# Altium schematic sheet USB_Host.SchDoc
size Letter
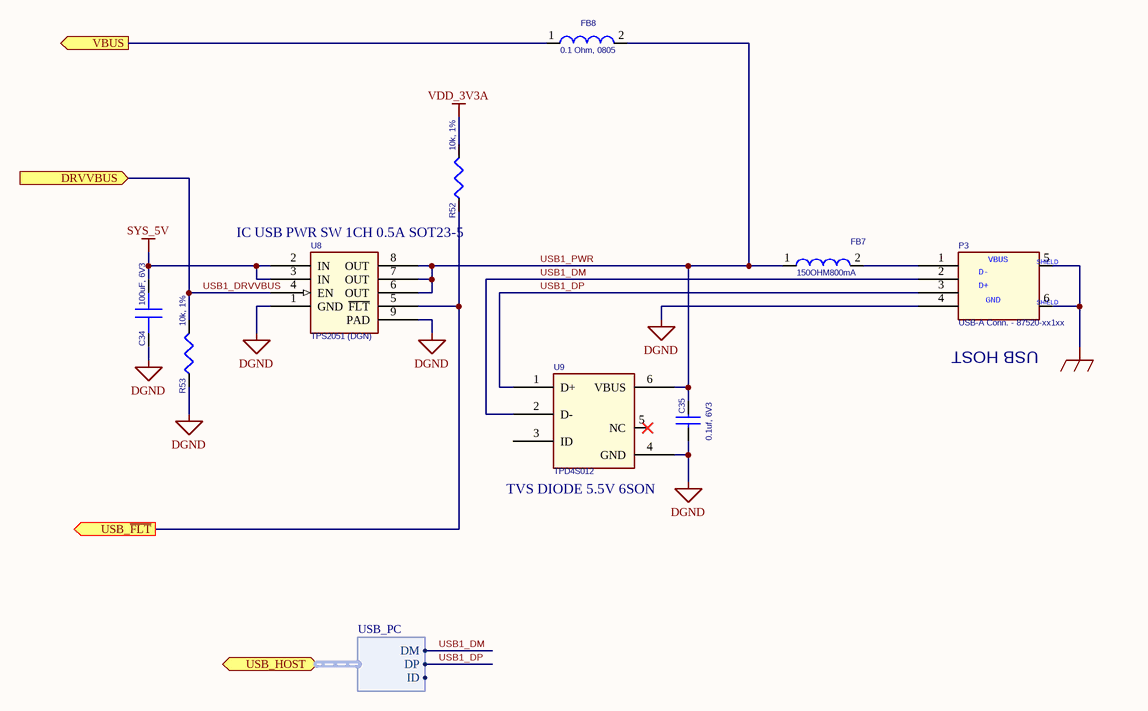
[diagram p0: USB_Host.SchDoc]

## Parts
C34  100uF, 6V3  [RD205SMD_250D]
C35  0.1uf, 6V3  [402]
FB7  150OHM800mA  [SM-7351-IND-0805]
FB8  0.1 Ohm, 0805  [SM-7351-IND-0805]
P3  USB-A Conn. - 87520-xx1xx  [usb_a_sh]
R52  10k, 1%  [402]
R53  10k, 1%  [402]
U8  TPS2051 (DGN)  [DGN-16X60]
U9  TPD4S012  [U_6_DRY]

## Ports
DRVVBUS (in), USB_HOST (harness USB_PC), USB_~{FLT} (out), VBUS (out)

## Harnesses
USB_PC: DM, DP, ID

## Nets
DGND: C34.2 C35.2 P3.4(P4) R53.2(P2) U8.1(GND) U8.9(PAD) U9.4(GND)
GND_EARTH: P3.5(SHELD1) P3.6(PAD4)
SYS_5V: C34.1 U8.2(IN) U8.3(IN)
VDD_3V3A: R52.1(P1)
USB1_DM: P3.2(P2) U9.2(D-) ; port USB_HOST.DM
USB1_DP: P3.3(P3) U9.1(D+) ; port USB_HOST.DP
USB1_DRVVBUS: R53.1(P1) U8.4(EN) ; port DRVVBUS
USB1_PWR: C35.1 FB7.1 FB8.2 U8.6(OUT) U8.7(OUT) U8.8(OUT) U9.6(VBUS)
USB_~{FLT}: R52.2(P2) U8.5(~{FLT}) ; port USB_~{FLT}
VBUS: FB8.1 ; port VBUS
NetFB7_2: FB7.2 P3.1(P1)

Not connected (* = marked no-connect by the designer): U9 3(ID) 5(NC)*

## Notes on the sheet
- IC USB PWR SW 1CH 0.5A SOT23-5
- (near P3) USB HOST
- (near U9) TVS DIODE 5.5V 6SON
- (in symbol CONN_54819-0578_2) VBUS; SHIELD; D-; D+; GND

## Library data of the parts
C34 = CAP SMD: CAP ALUM 100UF 6.3V 20% SMD; Manufacturer: Cornell Dubilier Electronics (CDE); Manufacturer Part Number: AVE107M06D16T-F; Capacitance: 100µF; Lifetime @ Temp.: 2000 Hrs @ 85°C; Ripple Current: 120mA; ESR (Equivalent Series Resistance): 4.64 Ohm; Surface Mount Land Size: 0.260" L x 0.260" W (6.60mm x 6.60mm); Supplier 1: Digi-Key; Supplier Part Number 1: 338-1787-6-ND; RoHS: RoHS Compliant; Category: Capacitors; Stock 1: 2601; Pricing 1: 1=0.17, 10=0.16, 100=0.133, 250=0.11844, 500=0.0987 (USD); Voltage Rating: 6.3V; Tolerance: ±20%; Operating Temperature: -40°C ~ 85°C; Features: General Purpose; Impedance: -; Mounting Type: Surface Mount; Package / Case: Radial, Can - SMD; Size / Dimension: 0.248" Dia (6.30mm); Height - Seated (Max): 0.209" (5.30mm); Lead Spacing: -; Packaging: Digi-Reel®; ComponentLink1URL: http://www.cde.com/catalogs/AVE.pdf; ComponentLink1Description: http://www.cde.com/catalogs/AVE.pdf
C35 = CAP_0.1uF_X7R_16V_10% 0402: CAP CER 0.1UF 6.3V 10% X5R 0402; Manufacturer: TDK Corporation; Manufacturer Part Number: C1005X5R0J104K050BA; Capacitance: 0.1µF; Supplier 1: Digi-Key; Supplier Part Number 1: 445-1266-6-ND; RoHS: RoHS Compliant; Category: Capacitors; Stock 1: 127604; Pricing 1: 1=0.1, 10=0.026, 100=0.0121, 250=0.00992, 500=0.00848, 1000=0.0066, 5000=0.0055 (USD); Voltage - Rated: 6.3V; Tolerance: ±10%; Temperature Coefficient: X5R; Mounting Type: Surface Mount, MLCC; Operating Temperature: -55°C ~ 85°C; Applications: General Purpose; Ratings: -; Package / Case: 0402 (1005 Metric); Size / Dimension: 0.039" L x 0.020" W (1.00mm x 0.50mm); Height - Seated (Max): -; Thickness (Max): 0.022" (0.55mm); Lead Spacing: -; Features: -; Packaging: Digi-Reel®; Lead Style: -; ComponentLink1URL: http://product.tdk.com/capacitor/mlcc/en/documents/mlcc_commercial_general_en.pdf; ComponentLink1Description: http://product.tdk.com/capacitor/mlcc/en/documents/mlcc_commercial_general_en.pdf
FB7 = FER_180_200_0: FERRITE 800MA 150 OHM 0805 SMD; PartName: FerriteBead150ohm800mA; Mfr: Steward; MfrNum: LI0805H151R-10; TIIntPartnumber: 1L0010; Manufacturer: Laird-Signal Integrity Products; Vendor: Digikey; Impedance @ Frequency: 150 Ohm @ 100MHz; DC Resistance (DCR): 150 mOhm Max; Filter Type: Differential Mode - Single; Supplier 1: Digi-Key; Supplier Part Number 1: 240-2384-6-ND; Manufacturer Part Number: LI0805H151R-10; RoHS: RoHS Compliant; Category: Filters; Stock 1: 3694; Pricing 1: 1=0.1, 10=0.07, 25=0.064, 50=0.0574, 100=0.0421, 250=0.03064, 500=0.02808, 1000=0.02424 (USD); Current Rating: 800mA; Package / Case: 0805 (2012 Metric); Mounting Type: Surface Mount; Packaging: Digi-Reel®; Height (Max): 0.043" (1.10mm); Size / Dimension: 0.079" L x 0.049" W (2.00mm x 1.25mm); ComponentLink1URL: http://www.lairdtech.com/WorkArea/linkit.aspx?LinkIdentifier=id&ItemID=4912; ComponentLink1Description: http://www.lairdtech.com/WorkArea/linkit.aspx?LinkIdentifier=id&ItemID=4912
FB8 = FER_180_200_0: RES .10 OHM 1/8W 5% 0805; Manufacturer: CTS Resistor Products; Manufacturer Part Number: 73L3R10J; Resistance (Ohms): 0.1; Power (Watts): 0.125W, 1/8W; Temperature Coefficient: ±200ppm/°C; Supplier 1: Digi-Key; Supplier Part Number 1: 73L3R10JDKR-ND; RoHS: RoHS Compliant; Category: Resistors; Stock 1: 1186; Pricing 1: 1=0.1, 10=0.066, 100=0.0267, 250=0.0204, 500=0.01632, 1000=0.01201 (USD); Composition: Thick Film; Features: Current Sense; Tolerance: ±5%; Package / Case: 0805 (2012 Metric); Supplier Device Package: 0805; Size / Dimension: 0.079" L x 0.049" W (2.00mm x 1.25mm); Height: 0.026" (0.65mm); Number of Terminations: 2; Packaging: Digi-Reel®; ComponentLink1URL: http://www.ctscorp.com/components/Datasheets/008-0337-0.pdf; ComponentLink1Description: http://www.ctscorp.com/components/Datasheets/008-0337-0.pdf
P3 = CONN_54819-0578_2: CONN RCPT USB TYPE A R/A PCB; Manufacturer: FCI; Manufacturer Part Number: 87520-0010BLF; CLASS: IO; TN: 224-0234-000; Number of Contacts: 4; Gender: Receptacle; Specifications: USB 2.0; Supplier 1: Digi-Key; Supplier Part Number 1: 609-1045-ND; RoHS: RoHS Compliant; Category: Connectors, Interconnects; Stock 1: 4363; Pricing 1: 1=0.78, 10=0.734, 25=0.6604, 50=0.587, 100=0.5626, 250=0.51368, 500=0.4892, 1000=0.40359, 2500=0.3669 (USD); Connector Type: USB - A; Mounting Type: Through Hole, Right Angle, Horizontal; Features: Board Lock; Packaging: Tube; Ingress Protection: -; ComponentLink1URL: http://portal.fciconnect.com/Comergent//fci/drawing/87520.pdf; ComponentLink1Description: http://portal.fciconnect.com/Comergent//fci/drawing/87520.pdf
R52 R53 = RES SMD: RES 10K OHM 1/16W 5% 0402 SMD; Manufacturer: Rohm Semiconductor; Manufacturer Part Number: MCR01MZPJ103; Power (Watts): 0.063W, 1/16W; Temperature Coefficient: ±200ppm/°C; Supplier 1: Digi-Key; Supplier Part Number 1: RHM10KJDKR-ND; RoHS: RoHS Compliant; Category: Resistors; Stock 1: 452072; Pricing 1: 1=0.1, 10=0.019, 25=0.014, 100=0.0078, 250=0.00596, 500=0.00476, 1000=0.0035, 5000=0.00251 (USD); Resistance (Ohms): 10k; Composition: Thick Film; Features: Automotive AEC-Q200 Qualified; Tolerance: ±5%; Package / Case: 0402 (1005 Metric); Supplier Device Package: 0402 (1005 Metric); Size / Dimension: 0.039" L x 0.020" W (1.00mm x 0.50mm); Height: 0.016" (0.40mm); Number of Terminations: 2; Packaging: Digi-Reel®; ComponentLink1URL: http://rohmfs.rohm.com/en/products/databook/datasheet/passive/resistor/chip_resistor/mcr_a.pdf; ComponentLink1Description: http://rohmfs.rohm.com/en/products/databook/datasheet/passive/resistor/chip_resistor/mcr_a.pdf
U8 = TPS2061_0: IC 1.5A PWR DIST SWITCH 8-SOIC; Manufacturer: Texas Instruments; Manufacturer Part Number: TPS2051BDGNR; Number of Outputs: 1; Rds (On): 135 mOhm; Internal Switch(s): Yes; Current Limit: 1A; Voltage - Input: 2.7 V ~ 5.5 V; Supplier 1: Digi-Key; Supplier Part Number 1: 296-17313-6-ND; RoHS: RoHS Compliant; Category: Integrated Circuits (ICs); Stock 1: 7065; Pricing 1: 1=1.82, 10=1.642, 25=1.4708, 100=1.3224, 250=1.1742, 500=1.026, 1000=0.8493 (USD); Type: High Side Switch; Operating Temperature: -40°C ~ 85°C; Mounting Type: Surface Mount; Package / Case: 8-TSSOP, 8-MSOP (0.118", 3.00mm Width) Exposed Pad; Supplier Device Package: 8-MSOP-PowerPad; Packaging: Digi-Reel®; ComponentLink1URL: http://www.ti.com/lit/ds/symlink/tps2051b.pdf; ComponentLink1Description: http://www.ti.com/lit/ds/symlink/tps2051b.pdf
U9 = PROT_TPD4S012: ESD 4channel USB Interface; Mfr: TI; MfrNum: TPD4S012DRY; TIIntPartnumber: 1A0233; Manufacturer: Texas Instruments; Manufacturer Part Number: TPD4S012DRYR; Vendor: Digikey; Cost100: 0.76; Cost10K: 0.23; Power (Watts): 60W; Number of Circuits: 4; PartName: TPD4S012; Supplier 1: Digi-Key; Supplier Part Number 1: 296-24244-6-ND; RoHS: RoHS Compliant; Category: Circuit Protection; Stock 1: 7978; Pricing 1: 1=0.78, 10=0.682, 25=0.6028, 100=0.2552, 250=0.25044, 500=0.2457, 750=0.24097 (USD); Voltage - Working: -; Voltage - Clamping: -; Technology: Mixed Technology; Applications: USB; Package / Case: 6-UFDFN; Supplier Device Package: 6-SON (1.45x1); Packaging: Digi-Reel®; ComponentLink1URL: http://www.ti.com/lit/ds/symlink/tpd4s012.pdf; ComponentLink1Description: http://www.ti.com/lit/ds/symlink/tpd4s012.pdf